# EAGLE design RPI_PICO_WH_PCB (EAGLE 9.7.0)
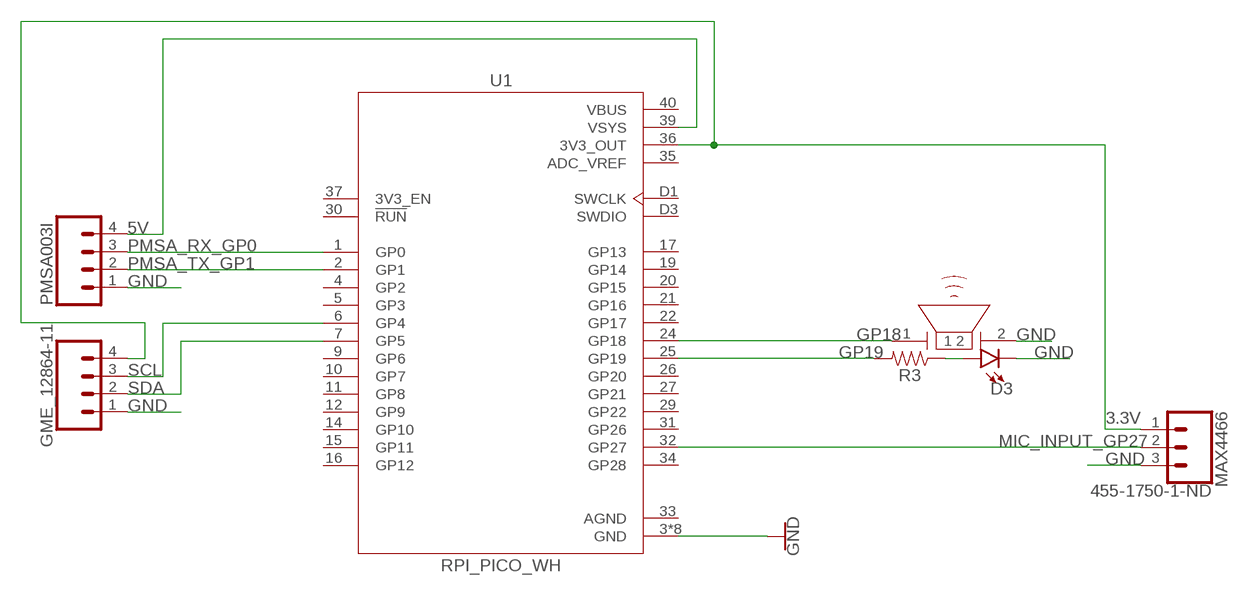
[diagram p0: schematic, sheet 1]

## Parts
D3  LED5MM  [LED_5MM]
GME_12864-11  CONN_04PTH  [1X04]
LS1  PIEZO  [PIEZO]
MAX4466  455-1750-1-ND  CONN_03  [1X03]
PMSA003I  CONN_04PTH  [1X04]
R3  RESISTORAXIAL-0.3  [AXIAL-0.3]
U1  RPI_PICO_WH  [PI_PICO_WH]

## Nets
3.3V: GME_12864-11.4 MAX4466.1 U1.36(3V3_OUT)
5V: PMSA003I.4 U1.39(VSYS)
GND: D3.K(C) GME_12864-11.1 LS1.2 MAX4466.3 PMSA003I.1 U1.3(GND) U1.8(GND) U1.13(GND) U1.18(GND) U1.23(GND) U1.28(GND) U1.38(GND) U1.D2(GND)
GP18: LS1.1 U1.24(GP18)
GP19: R3.P$2 U1.25(GP19)
MIC_INPUT_GP27: MAX4466.2 U1.32(GP27)
N$1: D3.A R3.P$1
PMSA_RX_GP0: PMSA003I.3 U1.1(GP0)
PMSA_TX_GP1: PMSA003I.2 U1.2(GP1)
SCL: GME_12864-11.3 U1.6(GP4)
SDA: GME_12864-11.2 U1.7(GP5)
Unconnected: U1.4(GP2) U1.5(GP3) U1.9(GP6) U1.10(GP7) U1.11(GP8) U1.12(GP9) U1.14(GP10) U1.15(GP11) U1.16(GP12) U1.17(GP13) U1.19(GP14) U1.20(GP15) U1.21(GP16) U1.22(GP17) U1.26(GP20) U1.27(GP21) U1.29(GP22) U1.30(!RUN) U1.31(GP26) U1.34(GP28) U1.37(3V3_EN) U1.D1(SWCLK) U1.D3(SWDIO)

## Power pins joined to a net without a drawn wire
ADC_VREF: U1.35(ADC_VREF)
AGND: U1.33(AGND)
VBUS: U1.40(VBUS)

## Library data of the parts
D3 = SparkFun-LED:LED: LED (Generic) Standard schematic elements and footprints for 5mm, 3mm, 1206, and 0603 sized LEDs. Generic LEDs with no color specified.
GME_12864-11 PMSA003I = SparkFun-Connectors:CONN_04: Multi connection point. Often used as Generic Header-pin footprint for 0.1 inch spaced/style header connections On any of the 0.1 inch spaced packages, you can populate with these: Break Away Headers - Straight <https://www.sparkfun.com/products/116> (PRT-00116) Break Away Male Headers - Right Angle <https://www.sparkfun.com/products/553> (PRT-00553) Female Headers <https://www.sparkfun.com/products/115> (PRT-00115) Break Away Headers - Machine Pin <https://www.sparkfun.com/products/117> (PRT-00117) Break Away Female Headers - Swiss Machine Pin <https://www.sparkfun.com/products/743> (PRT-00743) For SCREWTERMINALS and SPRING TERMINALS visit here: Screw Terimnals on SparkFun.com <https://www.sparkfun.com/search/results?term=Screw+Terminals> (5mm/3.5mm/2.54mm spacing) This device is also useful as a general connection point to wire up your design to another part of your project. Our various solder wires solder well into these plated through hole pads. Hook-Up Wire - Assortment (Stranded, 22 AWG) <https://www.sparkfun.com/products/11375> (PRT-11375) Hook-Up Wire - Assortment (Solid Core, 22 AWG) <https://www.sparkfun.com/products/11367> (PRT-11367) View the entire wire category on our website here <https://www.sparkfun.com/categories/141> Special notes: Molex polarized connector foot print use with SKU : PRT-08231 with associated crimp pins and housings. 1MM SMD Version SKU: PRT-10208; PROD_ID: CONN-09696
LS1 = Tinkercad:PIEZO: Piezoelectric Sounders / Buzzers Reference Datasheet <https://www.murata.com/products/productdata/8801054621726/SPEC-PKM17EPPH4001-B0.pdf?1517839212000>
MAX4466 = SparkFun-Connectors:CONN_03: Multi connection point. Often used as Generic Header-pin footprint for 0.1 inch spaced/style header connections On any of the 0.1 inch spaced packages, you can populate with these: Break Away Headers - Straight <https://www.sparkfun.com/products/116> (PRT-00116) Break Away Male Headers - Right Angle <https://www.sparkfun.com/products/553> (PRT-00553) Female Headers <https://www.sparkfun.com/products/115> (PRT-00115) Break Away Headers - Machine Pin <https://www.sparkfun.com/products/117> (PRT-00117) Break Away Female Headers - Swiss Machine Pin <https://www.sparkfun.com/products/743> (PRT-00743) Stackable Header - 3 Pin (Female, 0.1") <https://www.sparkfun.com/products/13875> (PRT-13875) For SCREWTERMINALS and SPRING TERMINALS visit here: Screw Terimnals on SparkFun.com <https://www.sparkfun.com/search/results?term=Screw+Terminals> (5mm/3.5mm/2.54mm spacing) This device is also useful as a general connection point to wire up your design to another part of your project. Our various solder wires solder well into these plated through hole pads. Hook-Up Wire - Assortment (Stranded, 22 AWG) <https://www.sparkfun.com/products/11375> (PRT-11375) Hook-Up Wire - Assortment (Solid Core, 22 AWG) <https://www.sparkfun.com/products/11367> (PRT-11367) View the entire wire category on our website here <https://www.sparkfun.com/categories/141> Special notes: Molex polarized connector foot print use with SKU : PRT-08232 with associated crimp pins and housings.; PROD_ID: XXX-00000
R3 = SparkFun-Resistors:RESISTOR: Generic Resistor Package
U1 = Development_Boards:RPI_PICO*_W: Raspberry Pi Pico W & Pico 2 W; CATEGORY_L1: Developement Boards; CATEGORY_L2: Evaluation Boards; DATASHEET: https://pip-assets.raspberrypi.com/categories/686-raspberry-pi-pico-w/documents/RP-008312-DS-1-pico-w-datasheet.pdf?disposition=inline; DESCRIPTION: CYW43439 RP2040 - 802.11 b/g/n (WiFi/WLAN/Wi-Fi 4) Bluetooth® 5.x (BLE) Transceiver 2.4GHz Evaluation Board; MANUFACTURER: Raspberry Pi; MPN: SC0919; OPERATING_TEMPERATURE: -20°C ~ 70°C; PACKAGE: Through Hole; PART_STATUS: Active; ROHS: Compliant; SERIES: RP2040

## Board
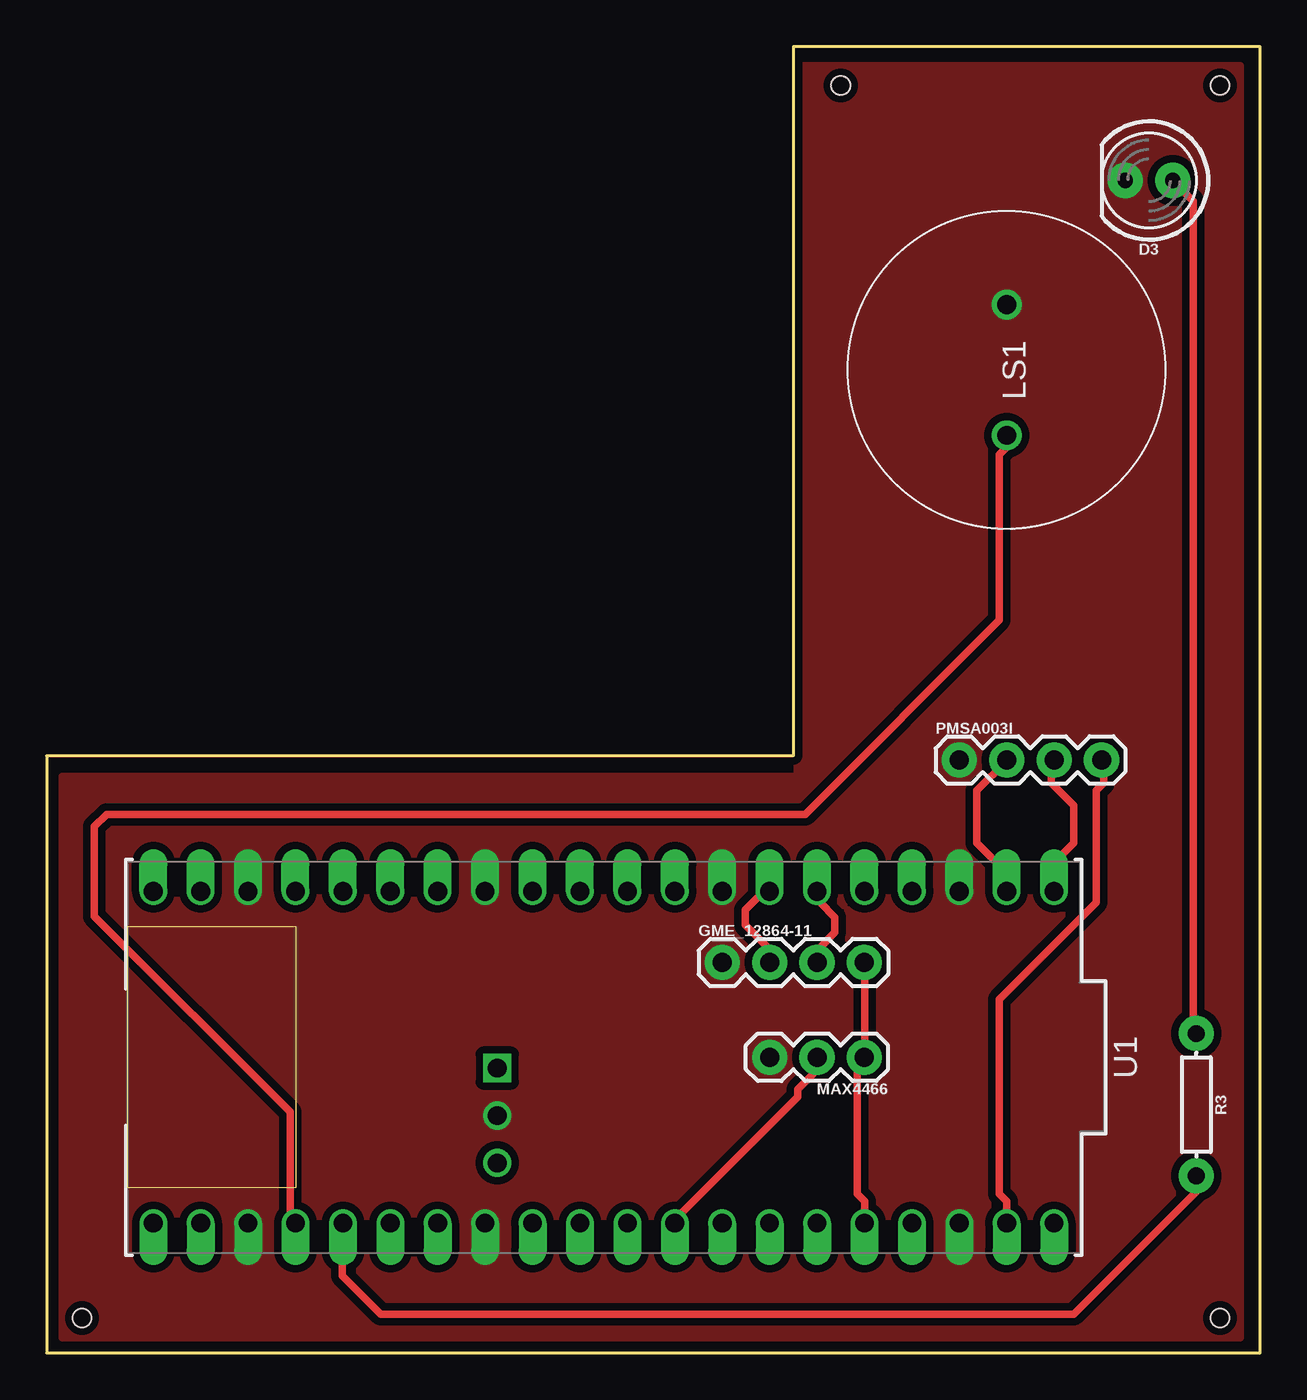
[diagram p1: board, top side]
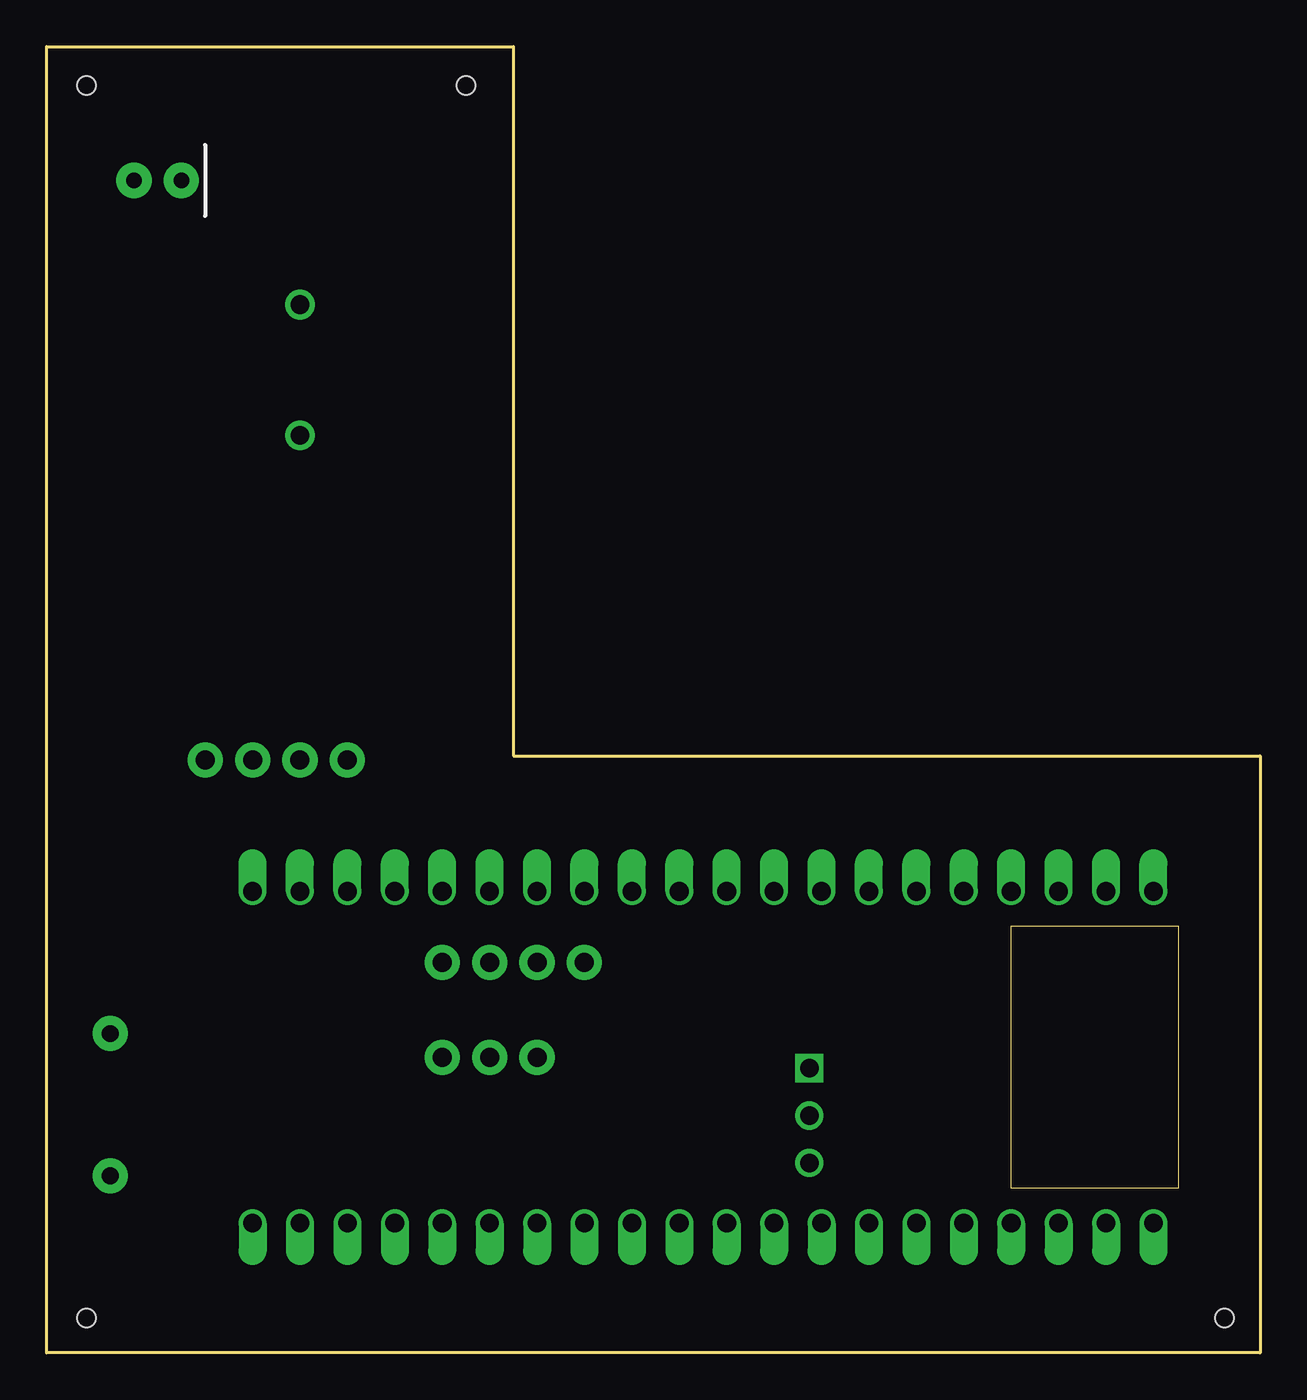
[diagram p2: board, bottom side, seen from below]

Size 65 x 70 mm. Coordinates in mm from the lower left corner, seen from the top.
Outline: 0,32 0,0 65,0 65,70 40,70 40,32 0,32
Copper layers (1*16): Top 0.035mm / dielectric 1.5mm / Bottom 0.035mm
Design rules "Fusion Electronics Design Rules": minimum track width 0.4mm, minimum drill 0.35mm, track to track 0.4mm, track to pad 0.4mm, pad to pad 0.4mm, via to via 6mil, smd to smd 6mil, copper to edge 0.4mm, drill to drill 6mil, minimum pad ring 10mil, minimum via ring 8mil, stop-mask expansion 4mil, vias tented up to drill 9999mil, thermal gap 10mil
Holes 1 mm at 1.9,1.87 62.86,1.87 42.54,67.91 62.86,67.91

### Footprints (pad centres in the part's own frame; a part is rotated, then mirrored left to right if it is on the bottom)
LED_5MM = drill 0.813 pad 1.88: A -1.27,0; K 1.27,0
1X04 = drill 1.016 pad 1.88: 1 0,0; 2 2.54,0; 3 5.08,0; 4 7.62,0
PIEZO = drill 1 pad 1.6: 1 -3.5,0; 2 3.5,0
1X03 = drill 1.016 pad 1.88: 1 0,0; 2 2.54,0; 3 5.08,0
AXIAL-0.3 = drill 0.9 pad 1.88: P$1 -3.81,0; P$2 3.81,0
PI_PICO_WH = drill 1 offset: 1 -8.89,24.13; 2 -8.89,21.59; 3 -8.89,19.05; 4 -8.89,16.51; 5 -8.89,13.97; 6 -8.89,11.43; 7 -8.89,8.89; 8 -8.89,6.35; 9 -8.89,3.81; 10 -8.89,1.27; 11 -8.89,-1.27; 12 -8.89,-3.81; 13 -8.89,-6.35; 14 -8.89,-8.89; 15 -8.89,-11.43; 16 -8.89,-13.97; 17 -8.89,-16.51; 18 -8.89,-19.05; 19 -8.89,-21.59; 20 -8.89,-24.13; 21 8.89,-24.13; 22 8.89,-21.59; 23 8.89,-19.05; 24 8.89,-16.51; 25 8.89,-13.97; 26 8.89,-11.43; 27 8.89,-8.89; 28 8.89,-6.35; 29 8.89,-3.81; 30 8.89,-1.27; 31 8.89,1.27; 32 8.89,3.81; 33 8.89,6.35; 34 8.89,8.89; 35 8.89,11.43; 36 8.89,13.97; 37 8.89,16.51; 38 8.89,19.05; 39 8.89,21.59; 40 8.89,24.13 | drill 1 square: D1 0.584,-5.7 | drill 1: D2 3.124,-5.7; D3 5.664,-5.7

### Placement (x,y rotation side)
D3  59.05,62.83 180 top
GME_12864-11  36.19,20.92 0 top
LS1  51.43,52.67 90 top
MAX4466  43.81,15.84 180 top
PMSA003I  48.89,31.76 0 top
R3  61.59,13.3 270 top
U1  29.84,15.84 270 top

### Tracks (layer width: path | path; a pad name or v marks a point on that pad's centre or on a via)
3.3V
  Top 0.4: U1.36 43.83,7.33 43.83,8.13 43.43,8.53 43.43,15.73 MAX4466.1 43.83,16.13 43.83,20.53 GME_12864-11.4
5V
  Top 0.4: U1.39 51.43,8.13 51.03,8.53 51.03,18.93 56.23,24.13 56.23,30.13 56.63,30.53 56.63,31.73 PMSA003I.4
GND
  pour Top (no thermals): 40.17,30.97 40.11,30.91 40.04,30.88 0.83,30.88 0.83,0.8 63.93,0.8 63.93,68.98 40.2,68.98 40.2,31.04
GP18
  Top 0.4: U1.24 13.05,7.3 13.05,12.91 2.56,23.4 2.56,28.2 3.22,28.86 40.63,28.86 51.03,39.26 51.03,48.13 51.83,48.93 51.43,49.33 LS1.1
GP19
  Top 0.4: R3.P$2 61.59,8.62 55.03,2.06 17.9,2.06 15.83,4.13 15.83,6.93 U1.25
MIC_INPUT_GP27
  Top 0.4: U1.32 33.83,7.33 40.23,13.73 40.23,14.13 41.03,14.93 41.03,15.73 MAX4466.2
N$1
  Top 0.4: D3.A 61.43,61.72 61.43,17.33 R3.P$1
PMSA_RX_GP0
  Top 0.4: U1.1 54.23,24.93 54.23,26.53 55.03,27.33 55.03,29.33 53.83,30.53 53.83,31.73 PMSA003I.3
PMSA_TX_GP1
  Top 0.4: U1.2 51.43,25.73 49.83,27.33 49.83,30.13 51.43,31.73 PMSA003I.2
SCL
  Top 0.4: U1.6 41.43,24.53 41.43,24.13 42.23,23.33 42.23,22.53 41.43,21.73 41.43,20.93 GME_12864-11.3
SDA
  Top 0.4: U1.7 38.63,24.53 38.23,24.53 37.43,23.73 37.43,22.93 38.63,21.73 38.63,20.93 GME_12864-11.2